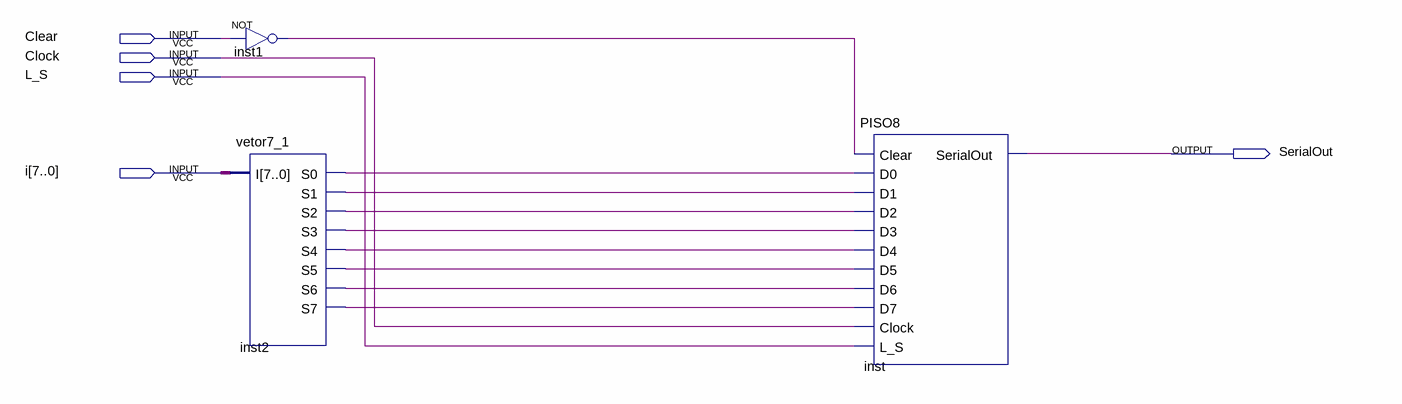
[diagram p0: schematic sheet]
// Quartus schematic PISO8_vetor.bdf as structural Verilog: 3 symbols, 5 pins
module PISO8_vetor (
  input  Clear,
  input  Clock,
  input  L_S,
  input  [7:0] i,
  output SerialOut
);

  wire inst1_out, inst2_s0, inst2_s1, inst2_s2, inst2_s3, inst2_s4, inst2_s5, inst2_s6, inst2_s7;

  not inst1 (inst1_out, Clear);
  vetor7_1 inst2 (
    .I(i), .S0(inst2_s0), .S1(inst2_s1), .S2(inst2_s2), .S3(inst2_s3), .S4(inst2_s4), .S5(inst2_s5),
    .S6(inst2_s6), .S7(inst2_s7));
  PISO8 inst (
    .Clear(inst1_out), .D0(inst2_s0), .D1(inst2_s1), .D2(inst2_s2), .D3(inst2_s3), .D4(inst2_s4),
    .D5(inst2_s5), .D6(inst2_s6), .D7(inst2_s7), .Clock(Clock), .L_S(L_S), .SerialOut(SerialOut));
endmodule
